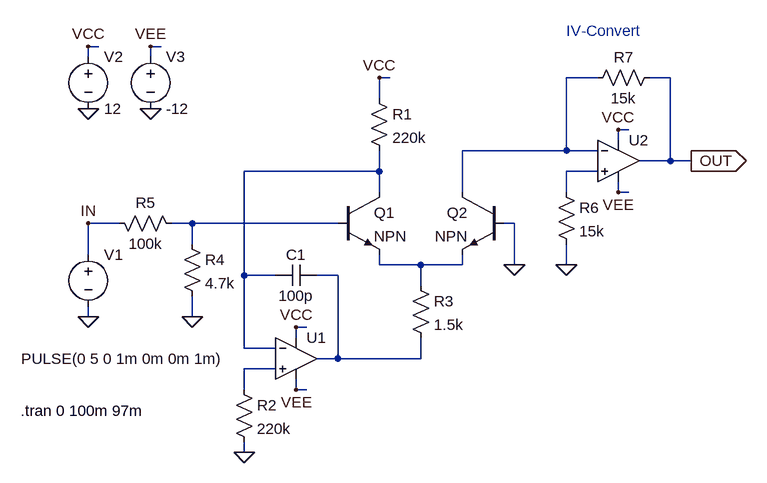
[diagram p0: schematic VCO_Antilog.asc]
VCO_Antilog.asc, the LTspice schematic file:
Version 4
SHEET 1 932 680
WIRE -96 -336 -112 -336
WIRE 0 -336 -16 -336
WIRE -112 -320 -112 -336
WIRE -16 -320 -16 -336
WIRE 352 -288 336 -288
WIRE 672 -288 624 -288
WIRE 784 -288 752 -288
WIRE 336 -256 336 -288
WIRE 720 -208 704 -208
WIRE 704 -192 704 -208
WIRE 624 -176 624 -288
WIRE 624 -176 464 -176
WIRE 672 -176 624 -176
WIRE 784 -160 784 -288
WIRE 784 -160 736 -160
WIRE 816 -160 784 -160
WIRE 336 -144 336 -176
WIRE 336 -144 128 -144
WIRE 672 -144 624 -144
WIRE 336 -112 336 -144
WIRE 464 -112 464 -176
WIRE 624 -112 624 -144
WIRE 704 -112 704 -128
WIRE 720 -112 704 -112
WIRE -64 -64 -112 -64
WIRE 48 -64 16 -64
WIRE 272 -64 48 -64
WIRE 544 -64 528 -64
WIRE 48 -32 48 -64
WIRE -112 -16 -112 -64
WIRE 336 0 336 -16
WIRE 400 0 336 0
WIRE 464 0 464 -16
WIRE 464 0 400 0
WIRE 544 0 544 -64
WIRE 624 0 624 -32
WIRE 128 16 128 -144
WIRE 176 16 128 16
WIRE 272 16 240 16
WIRE 400 32 400 0
WIRE -112 80 -112 64
WIRE 48 80 48 48
WIRE 224 96 208 96
WIRE 208 112 208 96
WIRE 128 128 128 16
WIRE 176 128 128 128
WIRE 272 144 272 16
WIRE 272 144 240 144
WIRE 400 144 400 112
WIRE 400 144 272 144
WIRE 176 160 128 160
WIRE 128 192 128 160
WIRE 208 192 208 176
WIRE 224 192 208 192
WIRE 128 288 128 272
FLAG 336 -288 VCC
FLAG 128 288 0
FLAG 208 96 VCC
FLAG 208 192 VEE
FLAG 544 0 0
FLAG 624 0 0
FLAG 704 -208 VCC
FLAG 704 -112 VEE
FLAG 48 80 0
FLAG -112 80 0
FLAG 816 -160 OUT
IOPIN 816 -160 Out
FLAG -112 -240 0
FLAG -16 -240 0
FLAG -112 -336 VCC
FLAG -16 -336 VEE
FLAG -112 -64 IN
SYMBOL Opamps\\UniversalOpamp2 208 144 R0
SYMATTR InstName U1
SYMBOL res 320 -272 R0
SYMATTR InstName R1
SYMATTR Value 220k
SYMBOL cap 240 0 R90
WINDOW 0 0 32 VBottom 2
WINDOW 3 32 32 VTop 2
SYMATTR InstName C1
SYMATTR Value 100p
SYMBOL res 112 176 R0
SYMATTR InstName R2
SYMATTR Value 220k
SYMBOL npn 272 -112 R0
SYMATTR InstName Q1
SYMBOL npn 528 -112 M0
SYMATTR InstName Q2
SYMBOL res 384 16 R0
SYMATTR InstName R3
SYMATTR Value 1.5k
SYMBOL res 32 -48 R0
SYMATTR InstName R4
SYMATTR Value 4.7k
SYMBOL res -80 -80 M90
WINDOW 0 0 56 VBottom 2
WINDOW 3 32 56 VTop 2
SYMATTR InstName R5
SYMATTR Value 100k
SYMBOL Opamps\\UniversalOpamp2 704 -160 R0
SYMATTR InstName U2
SYMBOL res 608 -128 R0
SYMATTR InstName R6
SYMATTR Value 15k
SYMBOL res 768 -304 R90
WINDOW 0 0 56 VBottom 2
WINDOW 3 32 56 VTop 2
SYMATTR InstName R7
SYMATTR Value 15k
SYMBOL voltage -112 -32 R0
WINDOW 3 -103 176 Left 2
WINDOW 123 0 0 Left 2
WINDOW 39 0 0 Left 2
SYMATTR Value PULSE(0 5 0 1m 0m 0m 1m)
SYMATTR InstName V1
SYMBOL voltage -112 -336 R0
WINDOW 123 0 0 Left 2
WINDOW 39 0 0 Left 2
SYMATTR InstName V2
SYMATTR Value 12
SYMBOL voltage -16 -336 R0
WINDOW 123 0 0 Left 2
WINDOW 39 0 0 Left 2
SYMATTR InstName V3
SYMATTR Value -12
TEXT -216 224 Left 2 !.tran 0 100m 97m
TEXT 624 -360 Left 2 ;IV-Convert

The netlist it stands for:
* VCO_Antilog.asc
XU1 N007 N002 VCC VEE N006 level.2 Avol=1Meg GBW=10Meg Slew=10Meg ilimit=25m rail=0 Vos=0 phimargin=45 en=0 enk=0 in=0 ink=0 Rin=500Meg  ; pins IN+ IN- V+ V- OUT
R1 VCC N002 220k
C1 N006 N002 100p
R2 N007 0 220k
Q1 N002 N004 N005 0 NPN
Q2 N001 0 N005 0 NPN
R3 N005 N006 1.5k
R4 N004 0 4.7k
R5 IN N004 100k
XU2 N003 N001 VCC VEE OUT level.2 Avol=1Meg GBW=10Meg Slew=10Meg ilimit=25m rail=0 Vos=0 phimargin=45 en=0 enk=0 in=0 ink=0 Rin=500Meg  ; pins IN+ IN- V+ V- OUT
R6 N003 0 15k
R7 OUT N001 15k
V1 IN 0 PULSE(0 5 0 1m 0m 0m 1m)
V2 VCC 0 12
V3 VEE 0 -12
.model NPN NPN
.model PNP PNP
.lib standard.bjt
.tran 0 100m 97m
* IV-Convert
.lib UniversalOpamps2.sub
.backanno
.end